# Altium schematic sheet deepshark_connector.SchDoc
size A4
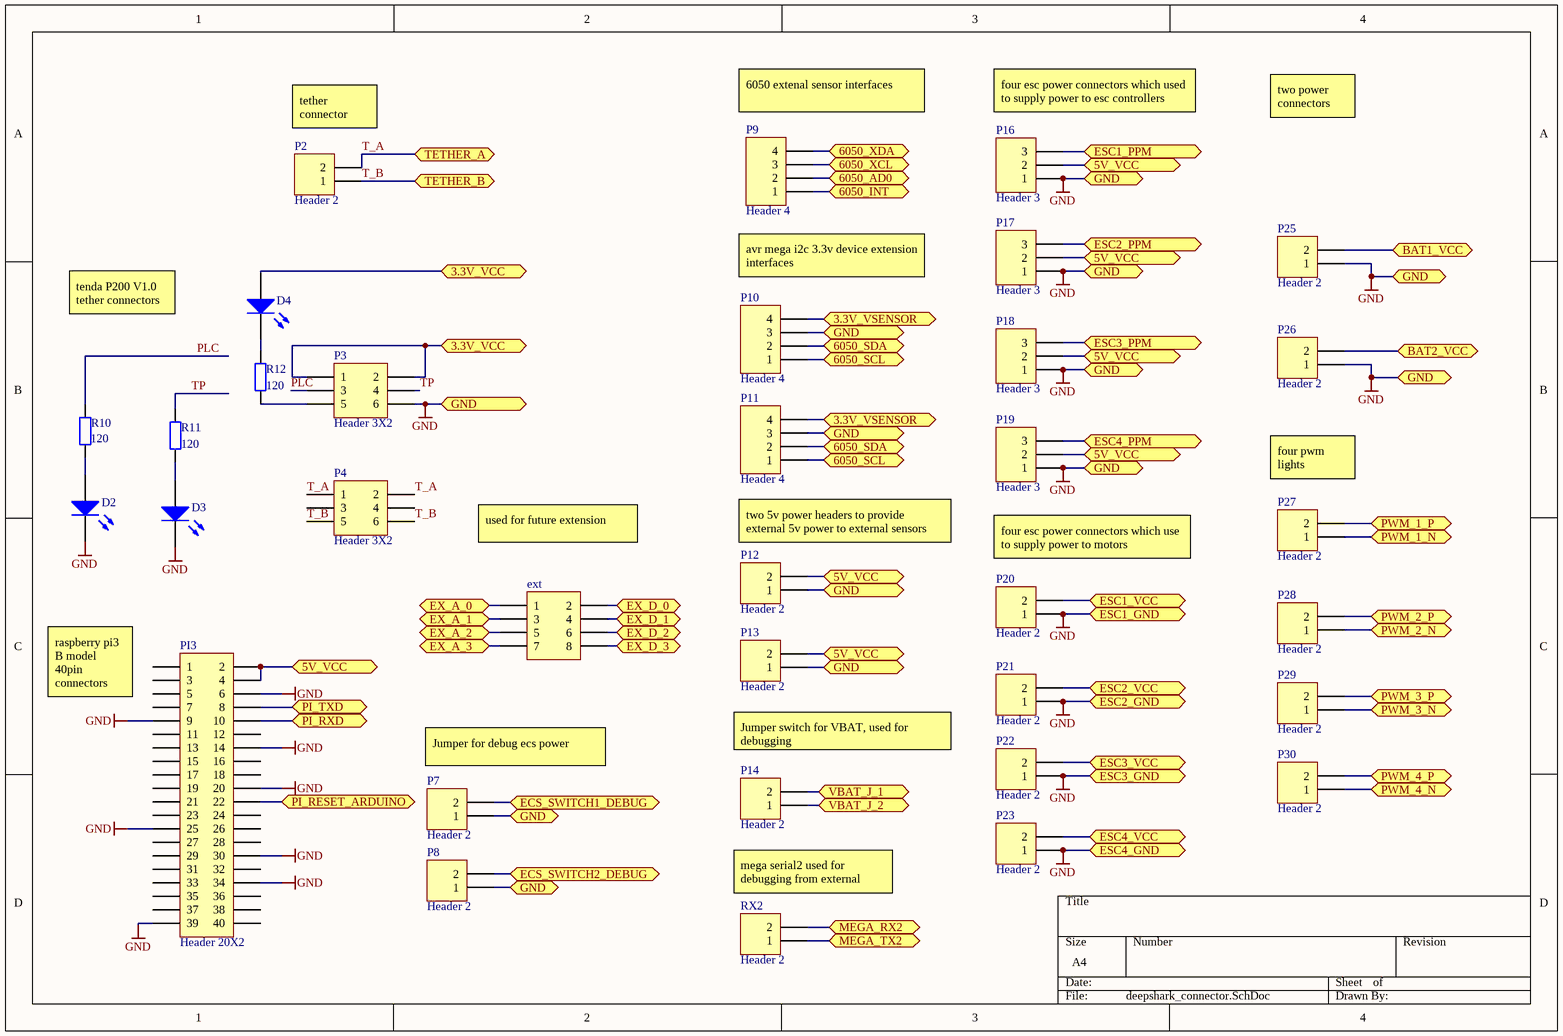
[diagram p0: deepshark_connector.SchDoc]

## Parts
D2  LED0  [6-0805_M]  (value not drawn)
D3  LED0  [6-0805_M]  (value not drawn)
D4  LED0  [6-0805_M]  (value not drawn)
ext  *  [HDR2X4]  (value not drawn)
P2  Header 2  [ConnectorBlue]
P3  Header 3X2  [HDR2X3]
P4  Header 3X2  [HDR2X3]
P7  Header 2  [HDR1X2]
P8  Header 2  [HDR1X2]
P9  Header 4  [HDR1X4]
P10  Header 4  [HDR1X4]
P11  Header 4  [HDR1X4]
P12  Header 2  [HDR1X2]
P13  Header 2  [HDR1X2]
P14  Header 2  [HDR1X2]
P16  Header 3  [HDR1X3]
P17  Header 3  [HDR1X3]
P18  Header 3  [HDR1X3]
P19  Header 3  [HDR1X3]
P20  Header 2  [ConnectorBlue]
P21  Header 2  [ConnectorBlue]
P22  Header 2  [ConnectorBlue]
P23  Header 2  [ConnectorBlue]
P25  Header 2  [ConnectorBlue]
P26  Header 2  [ConnectorBlue]
P27  Header 2  [headerX2]
P28  Header 2  [headerX2]
P29  Header 2  [headerX2]
P30  Header 2  [headerX2]
PI3  Header 20X2  [HDR2X20]
R10  value 120  [6-0805_M]  (hidden comment: Res2)
R11  value 120  [6-0805_M]  (hidden comment: Res2)
R12  value 120  [6-0805_M]  (hidden comment: Res2)
RX2  Header 2  [HDR1X2]

## Ports
3.3V_VCC, 3.3V_VSENSOR, 5V_VCC, 6050_AD0, 6050_INT, 6050_SCL, 6050_SDA, 6050_XCL, 6050_XDA, BAT1_VCC, BAT2_VCC, ECS_SWITCH1_DEBUG, ECS_SWITCH2_DEBUG, ESC1_GND, ESC1_PPM, ESC1_VCC, ESC2_GND, ESC2_PPM, ESC2_VCC, ESC3_GND, ESC3_PPM, ESC3_VCC, ESC4_GND, ESC4_PPM, ESC4_VCC, EX_A_0, EX_A_1, EX_A_2, EX_A_3, EX_D_0, EX_D_1, EX_D_2, EX_D_3, GND, MEGA_RX2, MEGA_TX2, PI_RESET_ARDUINO, PI_RXD, PI_TXD, PWM_1_N, PWM_1_P, PWM_2_N, PWM_2_P, PWM_3_N, PWM_3_P, PWM_4_N, PWM_4_P, TETHER_A (bidir), TETHER_B (bidir), VBAT_J_1, VBAT_J_2

## Nets
GND: D2.2(K) D3.2(K) P3.6 P7.1 P8.1 P10.3 P11.3 P12.1 P13.1 P16.1 P17.1 P18.1 P19.1 P20.1 P21.1 P22.1 P23.1 P25.1 P26.1 PI3.6 PI3.9 PI3.14 PI3.20 PI3.25 PI3.30 PI3.34 PI3.39 ; port GND, port ESC1_GND, port ESC2_GND, port ESC3_GND, port ESC4_GND
3.3V_VCC: D4.1(A) P3.1 P3.2 ; port 3.3V_VCC
3.3V_VSENSOR: P10.4 P11.4 ; port 3.3V_VSENSOR
5V_VCC: P12.2 P13.2 P16.2 P17.2 P18.2 P19.2 PI3.2 PI3.4 ; port 5V_VCC
6050_AD0: P9.2 ; port 6050_AD0
6050_INT: P9.1 ; port 6050_INT
6050_SCL: P10.1 P11.1 ; port 6050_SCL
6050_SDA: P10.2 P11.2 ; port 6050_SDA
6050_XCL: P9.3 ; port 6050_XCL
6050_XDA: P9.4 ; port 6050_XDA
BAT1_VCC: P25.2 ; port BAT1_VCC
BAT2_VCC: P26.2 ; port BAT2_VCC
ECS_SWITCH1_DEBUG: P7.2 ; port ECS_SWITCH1_DEBUG
ECS_SWITCH2_DEBUG: P8.2 ; port ECS_SWITCH2_DEBUG
ESC1_PPM: P16.3 ; port ESC1_PPM
ESC1_VCC: P20.2 ; port ESC1_VCC
ESC2_PPM: P17.3 ; port ESC2_PPM
ESC2_VCC: P21.2 ; port ESC2_VCC
ESC3_PPM: P18.3 ; port ESC3_PPM
ESC3_VCC: P22.2 ; port ESC3_VCC
ESC4_PPM: P19.3 ; port ESC4_PPM
ESC4_VCC: P23.2 ; port ESC4_VCC
EX_A_0: ext.1 ; port EX_A_0
EX_A_1: ext.3 ; port EX_A_1
EX_A_2: ext.5 ; port EX_A_2
EX_A_3: ext.7 ; port EX_A_3
EX_D_0: ext.2 ; port EX_D_0
EX_D_1: ext.4 ; port EX_D_1
EX_D_2: ext.6 ; port EX_D_2
EX_D_3: ext.8 ; port EX_D_3
MEGA_RX2: RX2.2 ; port MEGA_RX2
MEGA_TX2: RX2.1 ; port MEGA_TX2
PI_RESET_ARDUINO: PI3.22 ; port PI_RESET_ARDUINO
PI_RXD: PI3.10 ; port PI_RXD
PI_TXD: PI3.8 ; port PI_TXD
PLC: P3.3 R10.2
PWM_1_N: P27.1 ; port PWM_1_N
PWM_1_P: P27.2 ; port PWM_1_P
PWM_2_N: P28.1 ; port PWM_2_N
PWM_2_P: P28.2 ; port PWM_2_P
PWM_3_N: P29.1 ; port PWM_3_N
PWM_3_P: P29.2 ; port PWM_3_P
PWM_4_N: P30.1 ; port PWM_4_N
PWM_4_P: P30.2 ; port PWM_4_P
T_A: P2.2 P4.1 P4.2 ; port TETHER_A
T_B: P2.1 P4.5 P4.6 ; port TETHER_B
TP: P3.4 R11.2
VBAT_J_1: P14.2 ; port VBAT_J_1
VBAT_J_2: P14.1 ; port VBAT_J_2
NetD2_1: D2.1(A) R10.1
NetD3_1: D3.1(A) R11.1
NetD4_2: D4.2(K) R12.2
NetP3_5: P3.5 R12.1

Not connected (* = marked no-connect by the designer): P4 3 4; PI3 1 3 5 7 11 12 13 15 16 17 18 19 21 23 24 26 27 28 29 31 32 33 35 36 37 38 40

## Notes on the sheet
- (near P9) 6050 extenal sensor interfaces
- (near P16) four esc power connectors which used to supply power to esc controllers
- two power connectors
- (near P2) tether connector
- tenda P200 V1.0 tether connectors
- avr mega i2c 3.3v device extension interfaces
- (near P27) four pwm lights connectors
- used for future extension
- two 5v power headers to provide external 5v power to external sensors
- four esc power connectors which use to supply power to motors
- (near PI3) raspberry pi3 B model 40pin connectors
- (near P7) Jumper for debug ecs power
- Jumper switch for VBAT, used for debugging
- mega serial2 used for debugging from external

## Library data of the parts
D2-D4 = LED0: Typical INFRARED GaAs LED; Published: 8-Jun-2000; LatestRevisionDate: 08-Jul-2005; LatestRevisionNote: Mech Layer 1 removed.; PackageReference: LED-0; Publisher: Altium Limited; PackageDescription: LED; 2 Leads
ext = Header 4X2: Header, 4-Pin, Dual row; LatestRevisionDate: 17-Jul-2002; LatestRevisionNote: Re-released for DXP Platform.; Publisher: Altium Limited
P2 P7 P8 P12-P14 P20-P23 P25-P30 RX2 = Header 2: Header, 2-Pin; LatestRevisionDate: 17-Jul-2002; LatestRevisionNote: Re-released for DXP Platform.; Publisher: Altium Limited
P3 P4 = Header 3X2: Header, 3-Pin, Dual row; LatestRevisionDate: 17-Jul-2002; LatestRevisionNote: Re-released for DXP Platform.; Publisher: Altium Limited
P9-P11 = Header 4: Header, 4-Pin; LatestRevisionDate: 17-Jul-2002; LatestRevisionNote: Re-released for DXP Platform.; Publisher: Altium Limited
P16-P19 = Header 3: Header, 3-Pin; LatestRevisionDate: 17-Jul-2002; LatestRevisionNote: Re-released for DXP Platform.; Publisher: Altium Limited
PI3 = Header 20X2: Header, 20-Pin, Dual row; LatestRevisionDate: 17-Jul-2002; LatestRevisionNote: Re-released for DXP Platform.; Publisher: Altium Limited
R10-R12 = Res2: Resistor; Published: 8-Jun-2000; LatestRevisionDate: 17-Jul-2002; LatestRevisionNote: Re-released for DXP Platform.; PackageReference: AXIAL-0.4; Publisher: Altium Limited; PackageDescription: Axial Device, Thru-Hole; 2 Leads; 0.4 in Pin Spacing